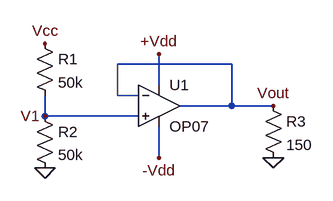
[diagram p0: schematic VoltageFollower.asc]
VoltageFollower.asc, the LTspice schematic file:
Version 4
SHEET 1 880 680
WIRE 480 80 304 80
WIRE 368 112 368 64
WIRE 304 128 304 80
WIRE 336 128 304 128
WIRE 480 144 480 80
WIRE 480 144 400 144
WIRE 544 144 480 144
WIRE 192 160 192 128
WIRE 336 160 192 160
WIRE 368 224 368 176
FLAG 192 240 0
FLAG 192 48 Vcc
FLAG 368 64 +Vdd
FLAG 368 224 -Vdd
FLAG 544 144 Vout
FLAG 544 224 0
FLAG 192 160 V1
SYMBOL res 176 32 R0
SYMATTR InstName R1
SYMATTR Value 50k
SYMBOL res 176 144 R0
SYMATTR InstName R2
SYMATTR Value 50k
SYMBOL OpAmps\\OP07 368 80 R0
SYMATTR InstName U1
SYMBOL res 528 128 R0
SYMATTR InstName R3
SYMATTR Value 150

The netlist it stands for:
* VoltageFollower.asc
R1 Vcc V1 50k
R2 V1 0 50k
XU1 V1 Vout +Vdd -Vdd Vout LT1001  ; OP07, pins In+ In- V+ V- OUT
R3 Vout 0 150
.lib LTC.lib
.backanno
.end